# Altium schematic sheet Antenna.SchDoc
size A4; SheetNumber: 4; SheetTotal: 4
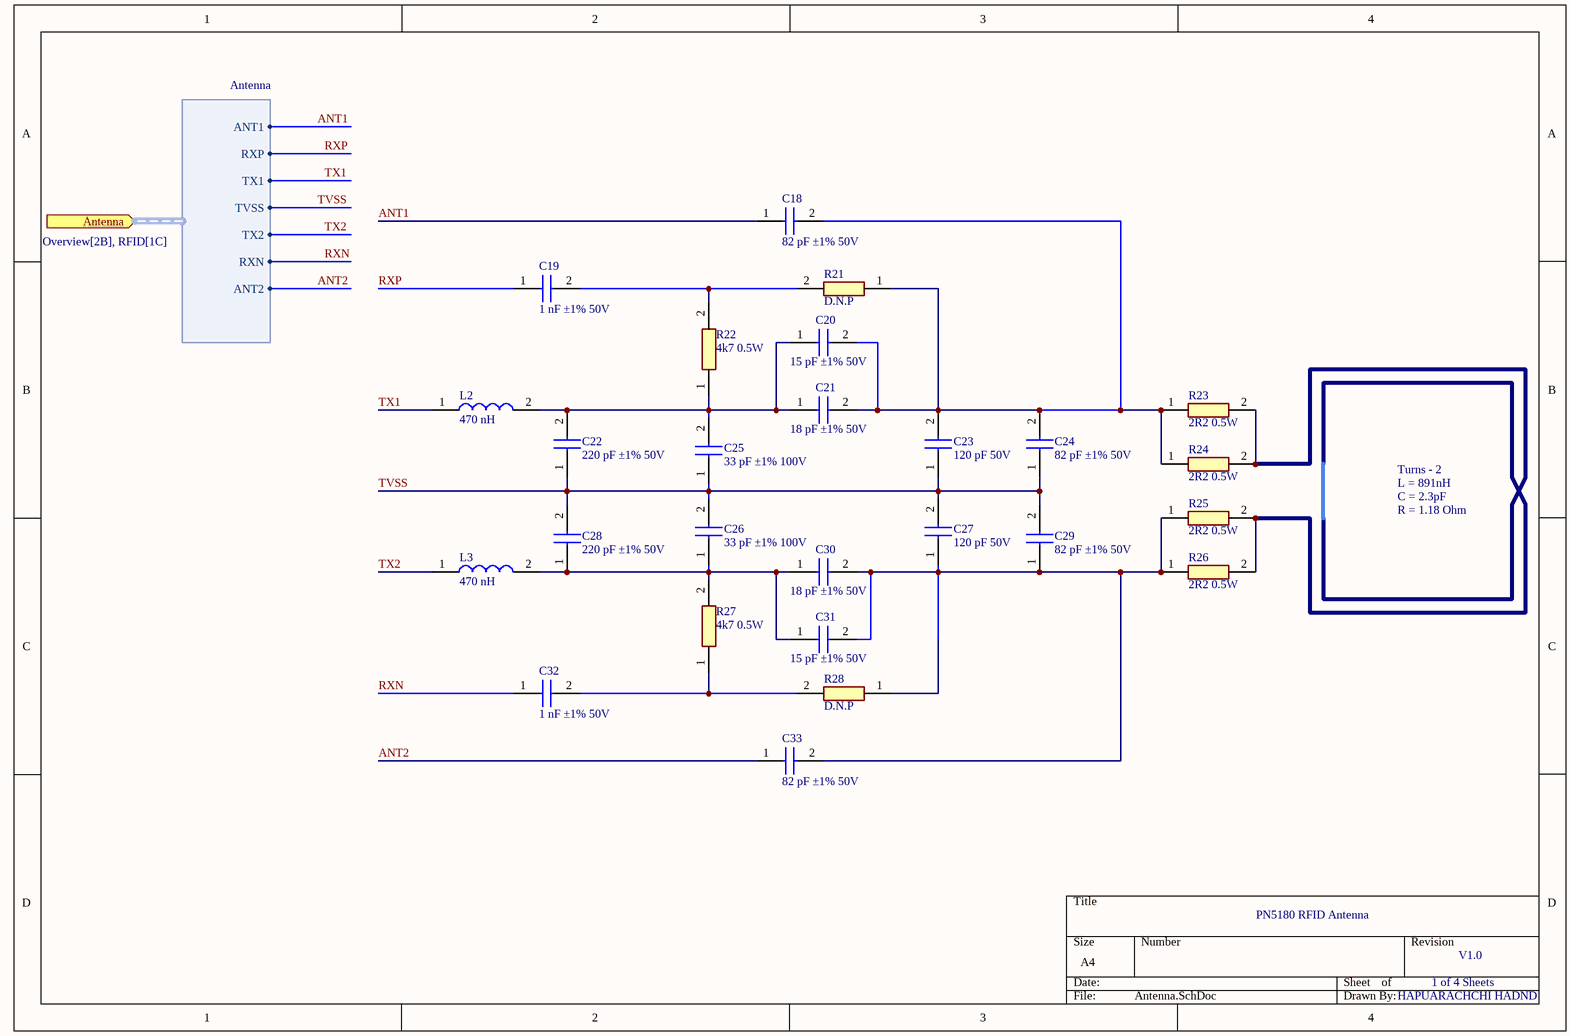
[diagram p0: Antenna.SchDoc]

## Parts
C18  82 pF ±1% 50V  [CAPC2012X94N_1]
C19  1 nF ±1% 50V  [CAPC2012X90N]
C20  15 pF ±1% 50V  [C0805]
C21  18 pF ±1% 50V  [CAPC2012X94N_2]
C22  220 pF ±1% 50V  [CAPC2012X94N_3]
C23  120 pF 50V  [CAPC2012X94N_5]
C24  82 pF ±1% 50V  [CAPC2012X94N_1]
C25  33 pF ±1% 100V  [CAPC2012X94N_4]
C26  33 pF ±1% 100V  [CAPC2012X94N_4]
C27  120 pF 50V  [CAPC2012X94N_5]
C28  220 pF ±1% 50V  [CAPC2012X94N_3]
C29  82 pF ±1% 50V  [CAPC2012X94N_1]
C30  18 pF ±1% 50V  [CAPC2012X94N_2]
C31  15 pF ±1% 50V  [C0805]
C32  1 nF ±1% 50V  [CAPC2012X90N]
C33  82 pF ±1% 50V  [CAPC2012X94N_1]
L2  470 nH  [INDC1608X95N]
L3  470 nH  [INDC1608X95N]
R21  D.N.P  [RESC2012X60N_1]
R22  4k7 0.5W  [RESC2012X60N_1]
R23  2R2 0.5W  [RESC2012X60N_2]
R24  2R2 0.5W  [RESC2012X60N_2]
R25  2R2 0.5W  [RESC2012X60N_2]
R26  2R2 0.5W  [RESC2012X60N_2]
R27  4k7 0.5W  [RESC2012X60N_1]
R28  D.N.P  [RESC2012X60N_1]

## Ports
Antenna (in, harness Antenna, see Overview[2B], RFID[1C])

## Harnesses
Antenna: ANT1, RXP, TX1, TVSS, TX2, RXN, ANT2

## Nets
ANT1: C18.1 ; port Antenna.ANT1
ANT2: C33.1 ; port Antenna.ANT2
RXN: C32.1 ; port Antenna.RXN
RXP: C19.1 ; port Antenna.RXP
TVSS: C22.1 C23.1 C24.1 C25.1 C26.2 C27.2 C28.2 C29.2 ; port Antenna.TVSS
TX1: L2.1 ; port Antenna.TX1
TX2: L3.1 ; port Antenna.TX2
NetC18_2: C18.2 C20.2 C21.2 C23.2 C24.2 R21.1 R23.1 R24.1
NetC19_2: C19.2 R21.2 R22.2
NetC20_1: C20.1 C21.1 C22.2 C25.2 L2.2 R22.1
NetC26_1: C26.1 C28.1 C30.1 C31.1 L3.2 R27.2
NetC27_1: C27.1 C29.1 C30.2 C31.2 C33.2 R25.1 R26.1 R28.1
NetC32_2: C32.2 R27.1 R28.2
NetR23_2: R23.2 R24.2 R25.2 R26.2

## Notes on the sheet
- L = 891nH
- Turns - 2
- C = 2.3pF
- R = 1.18 Ohm
- PN5180 RFID Antenna
- 1 of 4 Sheets
- V1.0
- HAPUARACHCHI HADND

## Library data of the parts
C18 C24 C29 C33 = 82pF: 82 pF ±1% 50V Ceramic Capacitor C0G, NP0 0805 (2012 Metric); Manufacturer_Name: Kyocera AVX; Manufacturer_Part_Number: 08055A820FAT2A; Datasheet Link: https://www.mouser.com/datasheet/2/40/C0GNP0_Dielectric-951274.pdf; Height: 0.94mm; Mouser Part Number: 581-08055A820FAT2A; Mouser Price/Stock: https://www.mouser.co.uk/ProductDetail/Kyocera-AVX/08055A820FAT2A?qs=PcWMbIuZCscXY%2FuloG0yJQ%3D%3D
C19 C32 = 1nF: 1 nF ±1% 50V Ceramic Capacitor C0G, NP0 0805 (2012 Metric); Manufacturer_Name: Vishay; Manufacturer_Part_Number: VJ0805A102FXACW1BC; Datasheet Link: https://www.arrow.com/en/products/vj0805a102fxacw1bc/vishay; Height: 0.9mm; Mouser Part Number: 77-VJ0805A102FXACBC; Mouser Price/Stock: https://www.mouser.com/Search/Refine.aspx?Keyword=77-VJ0805A102FXACBC; Arrow Part Number: VJ0805A102FXACW1BC; Arrow Price/Stock: https://www.arrow.com/en/products/vj0805a102fxacw1bc/vishay
C20 C31 = 15pF: 15 pF ±1% 50V Ceramic Capacitor C0G, NP0 0805 (2012 Metric); Manufacturer_Name: KEMET; Manufacturer_Part_Number: C0805C150F5GACTU; Datasheet Link: https://content.kemet.com/datasheets/KEM_C1003_C0G_SMD.pdf; Height: 1.1mm; Mouser Part Number: 80-C0805C150F5GACTU; Mouser Price/Stock: https://www.mouser.com/Search/Refine.aspx?Keyword=80-C0805C150F5GACTU
C21 C30 = 18pF: 18 pF ±1% 50V Ceramic Capacitor C0G, NP0 0805 (2012 Metric); Manufacturer_Name: Kyocera AVX; Manufacturer_Part_Number: 08055A180FAT2A; Datasheet Link: https://4donline.ihs.com/images/VipMasterIC/IC/AVXC/AVXC-S-A0014478390/AVXC-S-A0014712186-1.pdf?hkey=EF798316E3902B6ED9A73243A3159BB0; Height: 0.94mm; Mouser Part Number: 581-08055A180FAT2A; Mouser Price/Stock: https://www.mouser.com/Search/Refine.aspx?Keyword=581-08055A180FAT2A
C22 C28 = 220pF: 220 pF ±1% 50V Ceramic Capacitor C0G, NP0 0805 (2012 Metric); Manufacturer_Name: Kyocera AVX; Manufacturer_Part_Number: 08055A221FAT2A; Datasheet Link: https://www.mouser.com/datasheet/2/40/C0GNP0_Dielectric-951274.pdf; Height: 0.94mm; Mouser Part Number: 581-08055A221FAT2A; Mouser Price/Stock: https://www.mouser.co.uk/ProductDetail/AVX/08055A221FAT2A?qs=owscpGBW86VBfJF%2FIHQR%252BQ%3D%3D
C23 C27 = 120pF: 120 pF ±1% 50V Ceramic Capacitor C0G, NP0 0805 (2012 Metric); Manufacturer_Name: Kyocera AVX; Manufacturer_Part_Number: 08055A121FAT2A; Datasheet Link: https://componentsearchengine.com/Datasheets/1/08055A121FAT2A.pdf; Height: 0.94mm; Mouser Part Number: 581-08055A121F; Mouser Price/Stock: https://www.mouser.com/Search/Refine.aspx?Keyword=581-08055A121F
C25 C26 = 33pF: 33 pF ±1% 100V Ceramic Capacitor C0G, NP0 0805 (2012 Metric); Manufacturer_Name: Kyocera AVX; Manufacturer_Part_Number: 08051A330FAT2A; Datasheet Link: https://spicat.kyocera-avx.com/product/mlcc/chartview/08051A330FAT2A/DataSheet/NP0c; Height: 0.94mm; Mouser Part Number: 581-08051A330F; Mouser Price/Stock: https://www.mouser.co.uk/ProductDetail/AVX/08051A330FAT2A?qs=xS%252BL8w1%252B7NBUjm7pwPIlOg%3D%3D; Arrow Part Number: 08051A330FAT2A; Arrow Price/Stock: https://www.arrow.com/en/products/08051a330fat2a/avx
L2 L3 = 470nH: 470 nH Shielded Multilayer Inductor 400 mA 494mOhm Max 0603 (1608 Metric); Manufacturer_Name: TDK; Manufacturer_Part_Number: MLJ1608WR47JT000; Datasheet Link: https://product.tdk.com/system/files/dam/doc/product/inductor/inductor/smd/catalog/inductor_commercial_standard_mlj1608_en.pdf; Height: 0.95mm; Mouser Part Number: 810-MLJ1608WR47JT000; Mouser Price/Stock: https://www.mouser.co.uk/ProductDetail/TDK/MLJ1608WR47JT000?qs=XFe3dyCRgQg9kpQbVd6YyA%3D%3D; Arrow Part Number: MLJ1608WR47JT000; Arrow Price/Stock: https://www.arrow.com/en/products/mlj1608wr47jt000/tdk?region=nac
R21 R22 R27 R28 = 4k7Ohm_0805: 4.7 kOhms ±1% 0.5W, 1/2W Chip Resistor 0805 (2012 Metric) Automotive AEC-Q200, Pulse Withstanding Thick Film; Manufacturer_Name: Vishay; Manufacturer_Part_Number: CRCW08054K70FKEAHP; Datasheet Link: https://componentsearchengine.com/Datasheets/1/CRCW08051R00FKEAHP.pdf; Height: 0.6mm; Mouser Part Number: 71-CRCW08054K70FKEAH; Mouser Price/Stock: https://www.mouser.co.uk/ProductDetail/Vishay-Dale/CRCW08054K70FKEAHP?qs=k2%2FDWSARqgEa%252B2IrxOkJMA%3D%3D; Arrow Part Number: CRCW08054K70FKEAHP; Arrow Price/Stock: https://www.arrow.com/en/products/crcw08054k70fkeahp/vishay?utm_currency=USD&region=nac
R23-R26 = 2.2Ohm: 2.2 Ohms ±1% 0.5W, 1/2W Chip Resistor 0805 (2012 Metric) Automotive AEC-Q200, Pulse Withstanding Thick Film; Manufacturer_Name: Vishay; Manufacturer_Part_Number: CRCW08052R20FKEAHP; Datasheet Link: https://componentsearchengine.com/Datasheets/1/CRCW08051R00FKEAHP.pdf; Height: 0.6mm; Mouser Part Number: 71-CRCW08052R20FKEAH; Mouser Price/Stock: https://www.mouser.co.uk/ProductDetail/Vishay-Dale/CRCW08052R20FKEAHP?qs=40TFAHZMFvc8altFjF5kRw%3D%3D; Arrow Part Number: CRCW08052R20FKEAHP; Arrow Price/Stock: https://www.arrow.com/en/products/crcw08052r20fkeahp/vishay?utm_currency=USD&region=nac